# EAGLE schematic TM1638_UNO_RDA5807FP (EAGLE 9.6.2)
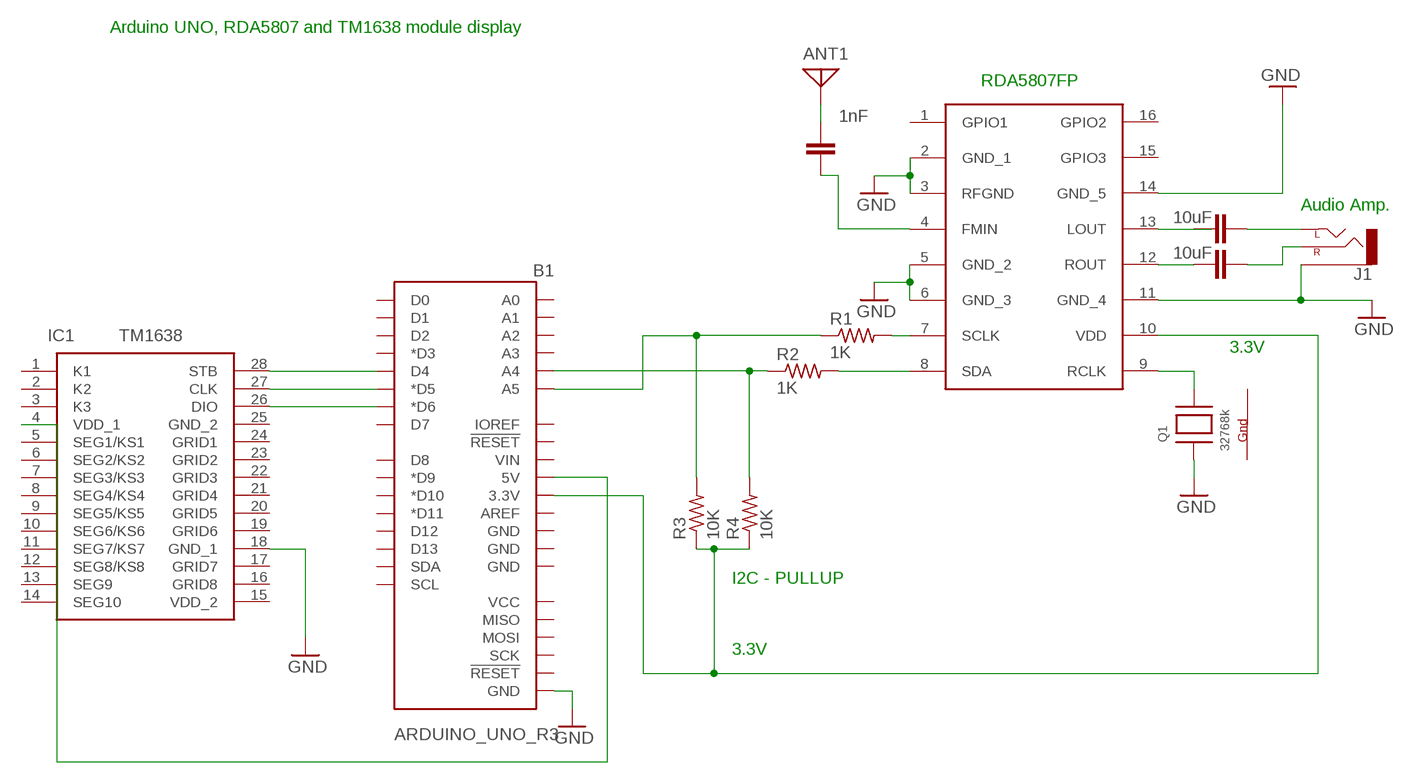
[diagram p0: schematic, sheet 1]
C1 (C): C: 1nF
C2 (C): C: 10uF
C3 (C): C: 10uF

## Parts
ANT1  ANTENNA  [PAD-01]
B1  ARDUINO_UNO_R3  [ARDUINO_R3]
IC1  TM1638  [SOIC127P1020X244-28N]
J1  AUDIO_JACK_2.5MMSPECIAL_POGO_PINS  [STEREOJACK2.5MM_SPECIAL_POGOPINS]
Q1  32768k  XTAL-4-3225  [NX3225]
R1  1K  R-US_0204/2V  [0204V]
R2  1K  R-US_0204/2V  [0204V]
R3  10K  R-US_0204/2V  [0204V]
R4  10K  R-US_0204/2V  [0204V]
U$1  RDA5807FPRDA5807FP  [RDA5807FP]

## Nets
GND: B1.GND@1(GND) IC1.18(GND_1) J1.RING1(SLEEVE) Q1.1(X1) U$1.2(GND_1) U$1.3(RFGND) U$1.5(GND_2) U$1.6(GND_3) U$1.11(GND_4) U$1.14(GND_5)
N$1: R1.2 U$1.7(SCLK)
N$2: R2.2 U$1.8(SDA)
N$3: U$1.13(LOUT)
N$4: B1.A5 R1.1 R3.2
N$5: B1.A4 R2.1 R4.2
N$7: U$1.12(ROUT)
N$8: J1.SHIELD(LEFT)
N$9: ANT1.1
N$10: B1.D4 IC1.28(STB)
N$11: U$1.4(FMIN)
N$12: J1.TIP(RIGHT)
N$13: Q1.3(X2) U$1.9(RCLK)
N$14: B1.D5(*D5) IC1.27(CLK)
N$15: B1.D6(*D6) IC1.26(DIO)
N$16: B1.5V IC1.4(VDD_1)
N$18: B1.3.3V R3.1 R4.1 U$1.10(VDD)
Unconnected: B1.A0 B1.A1 B1.A2 B1.A3 B1.AREF B1.D0 B1.D1 B1.D2 B1.D3(*D3) B1.D7 B1.D8 B1.D9(*D9) B1.D10(*D10) B1.D11(*D11) B1.D12 B1.D13 B1.GND@2(GND) B1.GND@3(GND) B1.GND@4(GND) B1.IOREF B1.MISO B1.MOSI B1.RESET@1(!RESET!) B1.RESET@2(!RESET!) B1.SCK B1.SCL B1.SDA B1.VCC B1.VIN IC1.1(K1) IC1.2(K2) IC1.3(K3) IC1.5(SEG1/KS1) IC1.6(SEG2/KS2) IC1.7(SEG3/KS3) IC1.8(SEG4/KS4) IC1.9(SEG5/KS5) IC1.10(SEG6/KS6) IC1.11(SEG7/KS7) IC1.12(SEG8/KS8) IC1.13(SEG9) IC1.14(SEG10) IC1.15(VDD_2) IC1.16(GRID8) IC1.17(GRID7) IC1.19(GRID6) IC1.20(GRID5) IC1.21(GRID4) IC1.22(GRID3) IC1.23(GRID2) IC1.24(GRID1) IC1.25(GND_2) U$1.1(GPIO1) U$1.15(GPIO3) U$1.16(GPIO2)

## Notes on the sheet
- Arduino UNO, RDA5807 and TM1638 module display
- RDA5807FP
- Audio Amp.
- 3.3V
- I2C - PULLUP
- 3.3V

## Power pins joined to a net without a drawn wire
G1: Q1.4(G1)
G2: Q1.2(G2)

## Library data of the parts
ANT1 = discrete:ANTENNA: Antenna
B1 = SparkFun-Boards:ARDUINO_UNO_R3: Arduino R3 Footprint with SPI header Arduino Uno R3 Compatible Footprint. Matches PCB size of the original board. SparkFun Products: SAMD21 Dev Breakout <https://www.sparkfun.com/products/13672> RedBoard <https://www.sparkfun.com/products/12757> R3 Stackable Headers <https://www.sparkfun.com/products/11417>
IC1 = TM1638:TM1638: LED Driver Controller Source: Datasheet <https://retrocip.cz/files/tm1638.pdf>; DESCRIPTION: LED Driver Controller; HEIGHT: 2.44mm; MANUFACTURER_NAME: TITAN MICRO ELECTRONICS; MANUFACTURER_PART_NUMBER: TM1638
J1 = SparkFun-Connectors:AUDIO_JACK_2.5MM: Audio Jack 2.5mm variants of PTH and SMT audio jacks. SparkFun Products: SparkFun PicoBoard <https://www.sparkfun.com/products/11888>- 2.5mm SMD
Q1 = adafruit:XTAL-4: Classic 4-pin 3.2 x 2.5mm crystal
R1-R4 = adafruit:R-US_: RESISTOR, American symbol
U$1 = RDA5807FP:RDA5807FP